# Altium project PowerBoard.PrjPcb
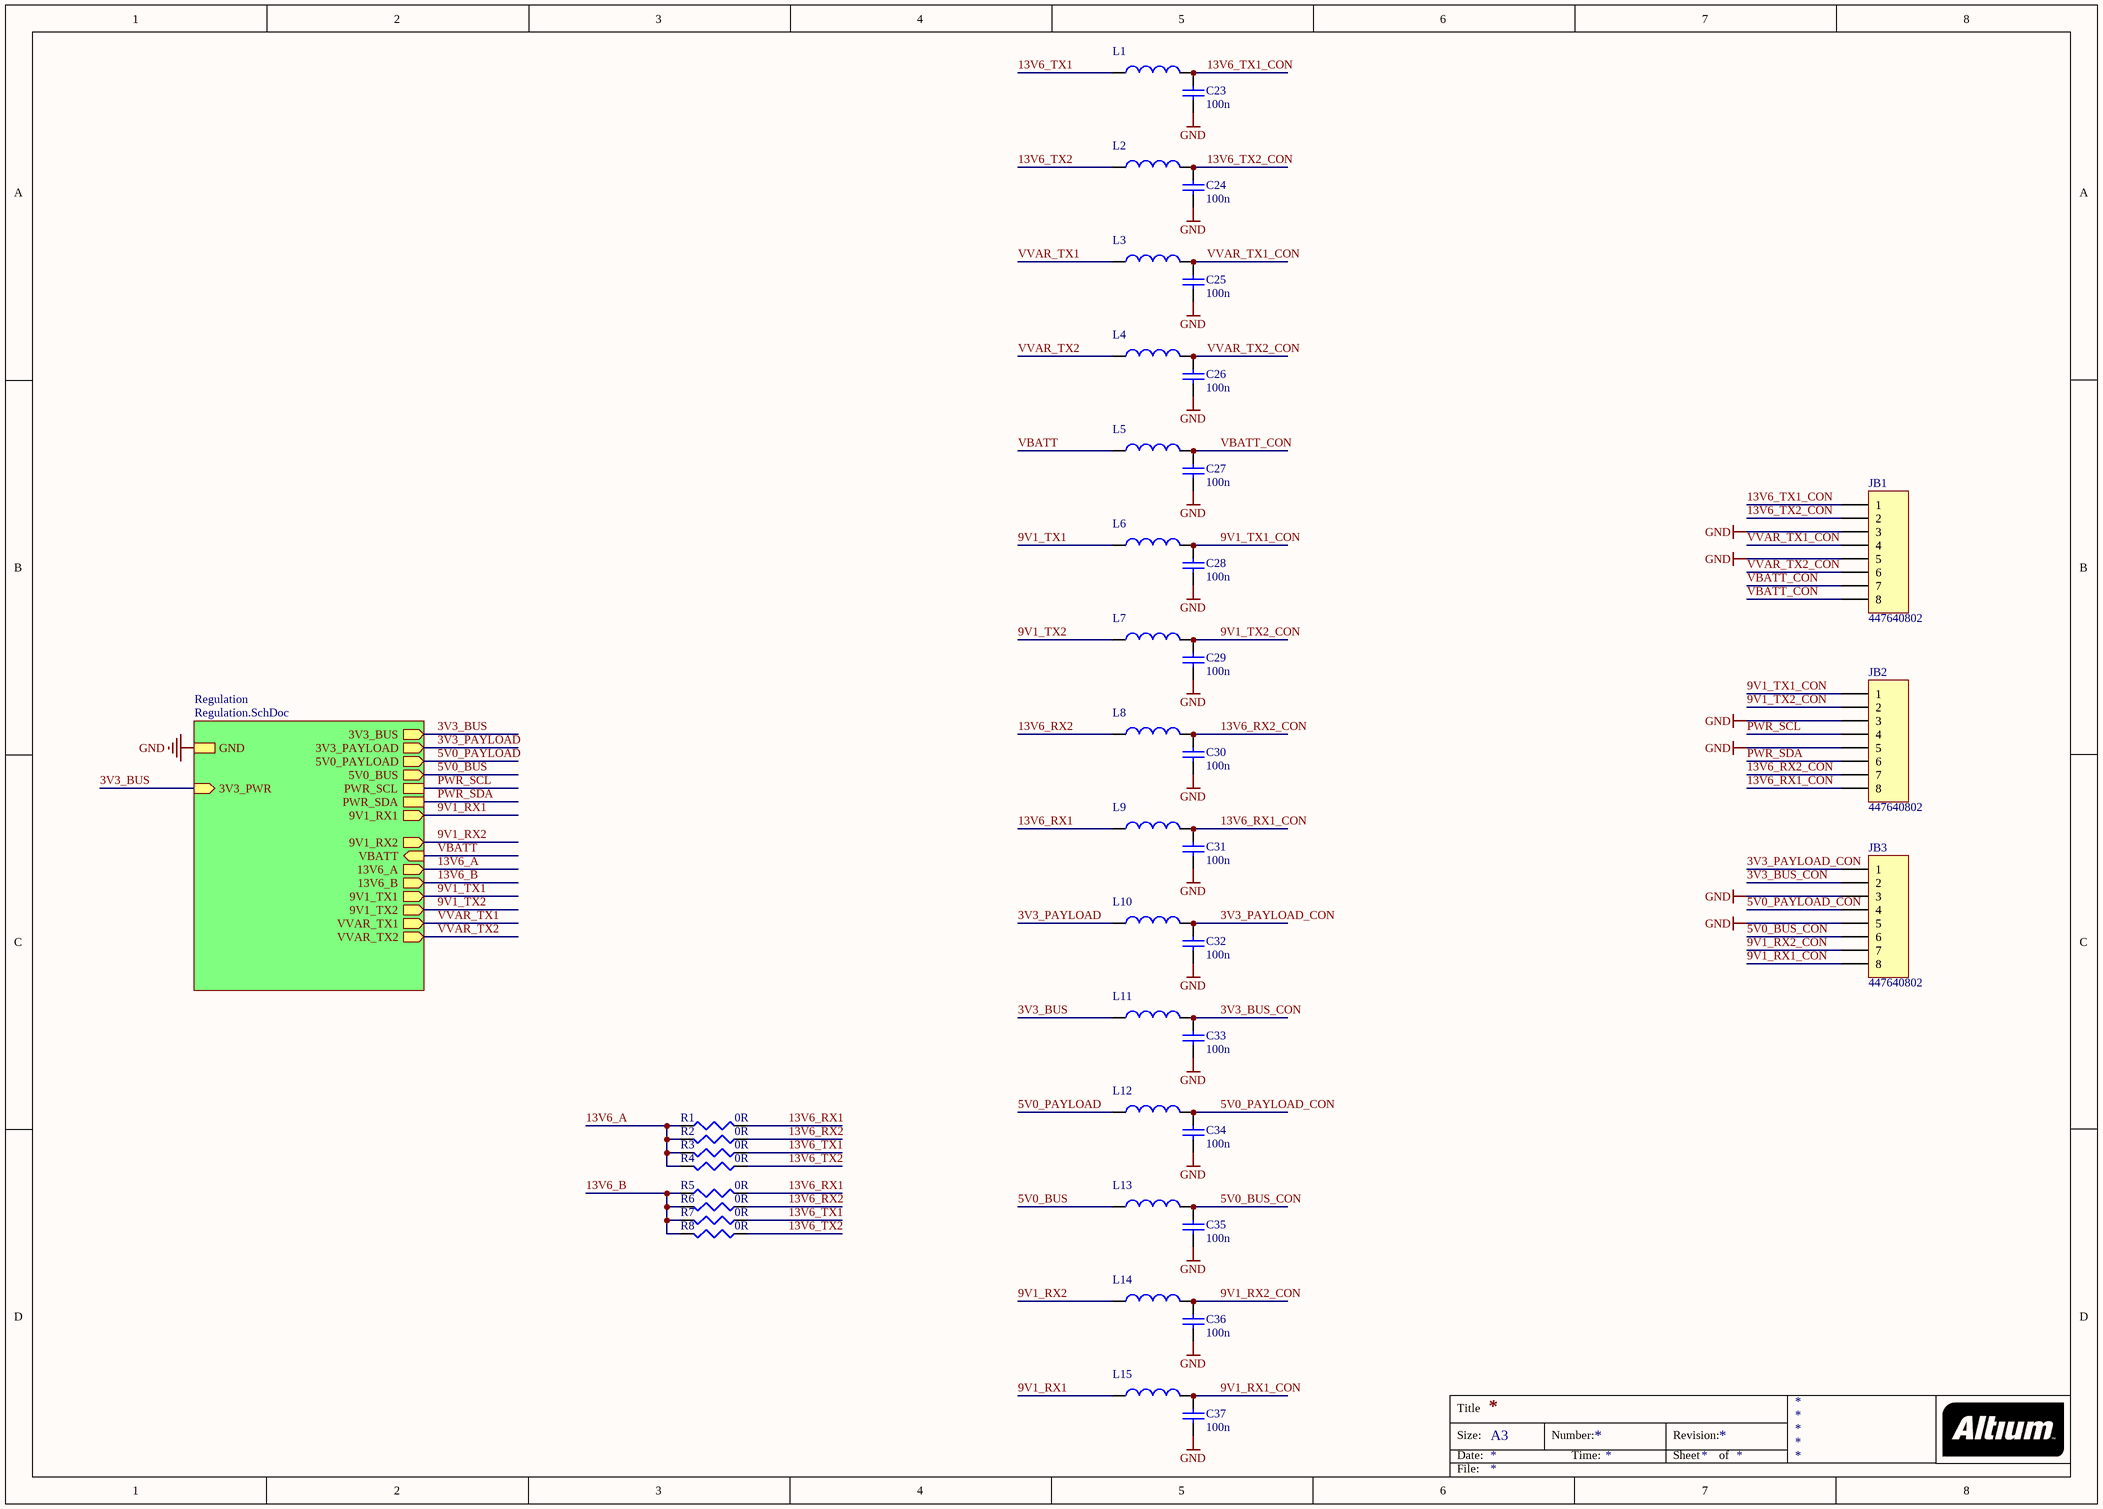
[diagram p0: PowerBoard.SchDoc]
3 sheets, 319 parts. Net scope: strictly hierarchical (ports join the sheet entries above them; power ports are local).
Board files: RedundantReg_Proto.PcbDoc, PowerBoard.PcbDoc
Sheets:
  PowerBoard.SchDoc
    Regulation = Regulation.SchDoc
      13V6 = RedundantReg.SchDoc
      9V1 = RedundantReg.SchDoc
      5V0 = RedundantReg.SchDoc
      3V3 = RedundantReg.SchDoc
      VVAR = RedundantReg.SchDoc

## Sheet PowerBoard.SchDoc
size A3

### Parts
C23  value 100n  [R0805M]
C24  value 100n  [R0805M]
C25  value 100n  [R0805M]
C26  value 100n  [R0805M]
C27  value 100n  [R0805M]
C28  value 100n  [R0805M]
C29  value 100n  [R0805M]
C30  value 100n  [R0805M]
C31  value 100n  [R0805M]
C32  value 100n  [R0805M]
C33  value 100n  [R0805M]
C34  value 100n  [R0805M]
C35  value 100n  [R0805M]
C36  value 100n  [R0805M]
C37  value 100n  [R0805M]
JB1  447640802  [MOLEX 447640802]
JB2  447640802  [MOLEX 447640802]
JB3  447640802  [MOLEX 447640802]
L1  BLM31PG121SN1L  [INDC3216M]  (value not drawn)
L2  BLM31PG121SN1L  [INDC3216M]  (value not drawn)
L3  BLM31PG121SN1L  [INDC3216M]  (value not drawn)
L4  BLM31PG121SN1L  [INDC3216M]  (value not drawn)
L5  BLM31PG121SN1L  [INDC3216M]  (value not drawn)
L6  BLM31PG121SN1L  [INDC3216M]  (value not drawn)
L7  BLM31PG121SN1L  [INDC3216M]  (value not drawn)
L8  BLM31PG121SN1L  [INDC3216M]  (value not drawn)
L9  BLM31PG121SN1L  [INDC3216M]  (value not drawn)
L10  BLM31PG121SN1L  [INDC3216M]  (value not drawn)
L11  BLM31PG121SN1L  [INDC3216M]  (value not drawn)
L12  BLM31PG121SN1L  [INDC3216M]  (value not drawn)
L13  BLM31PG121SN1L  [INDC3216M]  (value not drawn)
L14  BLM31PG121SN1L  [INDC3216M]  (value not drawn)
L15  BLM31PG121SN1L  [INDC3216M]  (value not drawn)
R1  value 0R  [R0402M]
R2  value 0R  [R0402M]
R3  value 0R  [R0402M]
R4  value 0R  [R0402M]
R5  value 0R  [R0402M]
R6  value 0R  [R0402M]
R7  value 0R  [R0402M]
R8  value 0R  [R0402M]

### Sub-sheets
Regulation = Regulation.SchDoc: 5V0_BUS (out), 3V3_BUS (out), 5V0_PAYLOAD (out), 3V3_PAYLOAD (out), 9V1_RX1 (out), 9V1_RX2 (out), VBATT (in), GND, 3V3_PWR (in), VVAR_TX1 (out), 13V6_A (out), 9V1_TX1 (out), VVAR_TX2 (out), 13V6_B (out), 9V1_TX2 (out), PWR_SCL, PWR_SDA

### Nets
3V3_BUS: L11.1 ; sheet Regulation/3V3_BUS, sheet Regulation/3V3_PWR
3V3_PAYLOAD: L10.1 ; sheet Regulation/3V3_PAYLOAD
5V0_BUS: L13.1 ; sheet Regulation/5V0_BUS
5V0_PAYLOAD: L12.1 ; sheet Regulation/5V0_PAYLOAD
9V1_RX1: L15.1 ; sheet Regulation/9V1_RX1
9V1_RX2: L14.1 ; sheet Regulation/9V1_RX2
9V1_TX1: L6.1 ; sheet Regulation/9V1_TX1
9V1_TX2: L7.1 ; sheet Regulation/9V1_TX2
13V6_A: R1.1 R2.2 R3.2 R4.2 ; sheet Regulation/13V6_A
13V6_B: R5.1 R6.2 R7.2 R8.2 ; sheet Regulation/13V6_B
GND: C23.2 C24.2 C25.2 C26.2 C27.2 C28.2 C29.2 C30.2 C31.2 C32.2 C33.2 C34.2 C35.2 C36.2 C37.2 JB1.3 JB1.5 JB2.3 JB2.5 JB3.3 JB3.5 ; sheet Regulation/GND
VBATT: L5.1 ; sheet Regulation/VBATT
VVAR_TX1: L3.1 ; sheet Regulation/VVAR_TX1
VVAR_TX2: L4.1 ; sheet Regulation/VVAR_TX2
3V3_BUS_CON: C33.1 JB3.2 L11.2
3V3_PAYLOAD_CON: C32.1 JB3.1 L10.2
5V0_BUS_CON: C35.1 JB3.6 L13.2
5V0_PAYLOAD_CON: C34.1 JB3.4 L12.2
9V1_RX1_CON: C37.1 JB3.8 L15.2
9V1_RX2_CON: C36.1 JB3.7 L14.2
9V1_TX1_CON: C28.1 JB2.1 L6.2
9V1_TX2_CON: C29.1 JB2.2 L7.2
13V6_RX1: L9.1 R1.2 R5.2
13V6_RX1_CON: C31.1 JB2.8 L9.2
13V6_RX2: L8.1 R2.1 R6.1
13V6_RX2_CON: C30.1 JB2.7 L8.2
13V6_TX1: L1.1 R3.1 R7.1
13V6_TX1_CON: C23.1 JB1.1 L1.2
13V6_TX2: L2.1 R4.1 R8.1
13V6_TX2_CON: C24.1 JB1.2 L2.2
PWR_SCL: JB2.4 ; sheet Regulation/PWR_SCL
PWR_SDA: JB2.6 ; sheet Regulation/PWR_SDA
VBATT_CON: C27.1 JB1.7 JB1.8 L5.2
VVAR_TX1_CON: C25.1 JB1.4 L3.2
VVAR_TX2_CON: C26.1 JB1.6 L4.2

### Notes on the sheet
- Title
- Size:
- Date:
- A3
- Number:
- Time:
- Revision:
- Sheet
- of
- File:

### Library data of the parts
C23-C37 = Cap: Capacitor; Published: 8-Jun-2000; LatestRevisionDate: 17-Jul-2002; LatestRevisionNote: Re-released for DXP Platform.; PackageReference: RAD-0.3; Publisher: Altium Limited; PackageDescription: Radial Cap, Thru-Hole; 2 Leads; 0.3 in Pin Spacing
JB1-JB3 = MOLEX 447640802: B2B RA Receptacle
L1-L15 = Inductor: Ferrite Bead; Code_IEC: 3216M; Value: 120R@100MHz; Published: 8-Jun-2000; LatestRevisionDate: 29-May-2009; LatestRevisionNote: IPC-7351 Footprint Added.; PackageReference: 3216; Publisher: Altium Limited; PackageDescription: Ferrite Bead; Code_JEITA: 1206M
R1-R8 = Res3: Resistor; Published: 8-Jun-2000; LatestRevisionDate: 29-May-2009; LatestRevisionNote: IPC-7351 Footprint Added.; PackageReference: J1-0603; Publisher: Altium Limited; PackageDescription: Chip Resistor

## Sheet Regulation.SchDoc
size A3
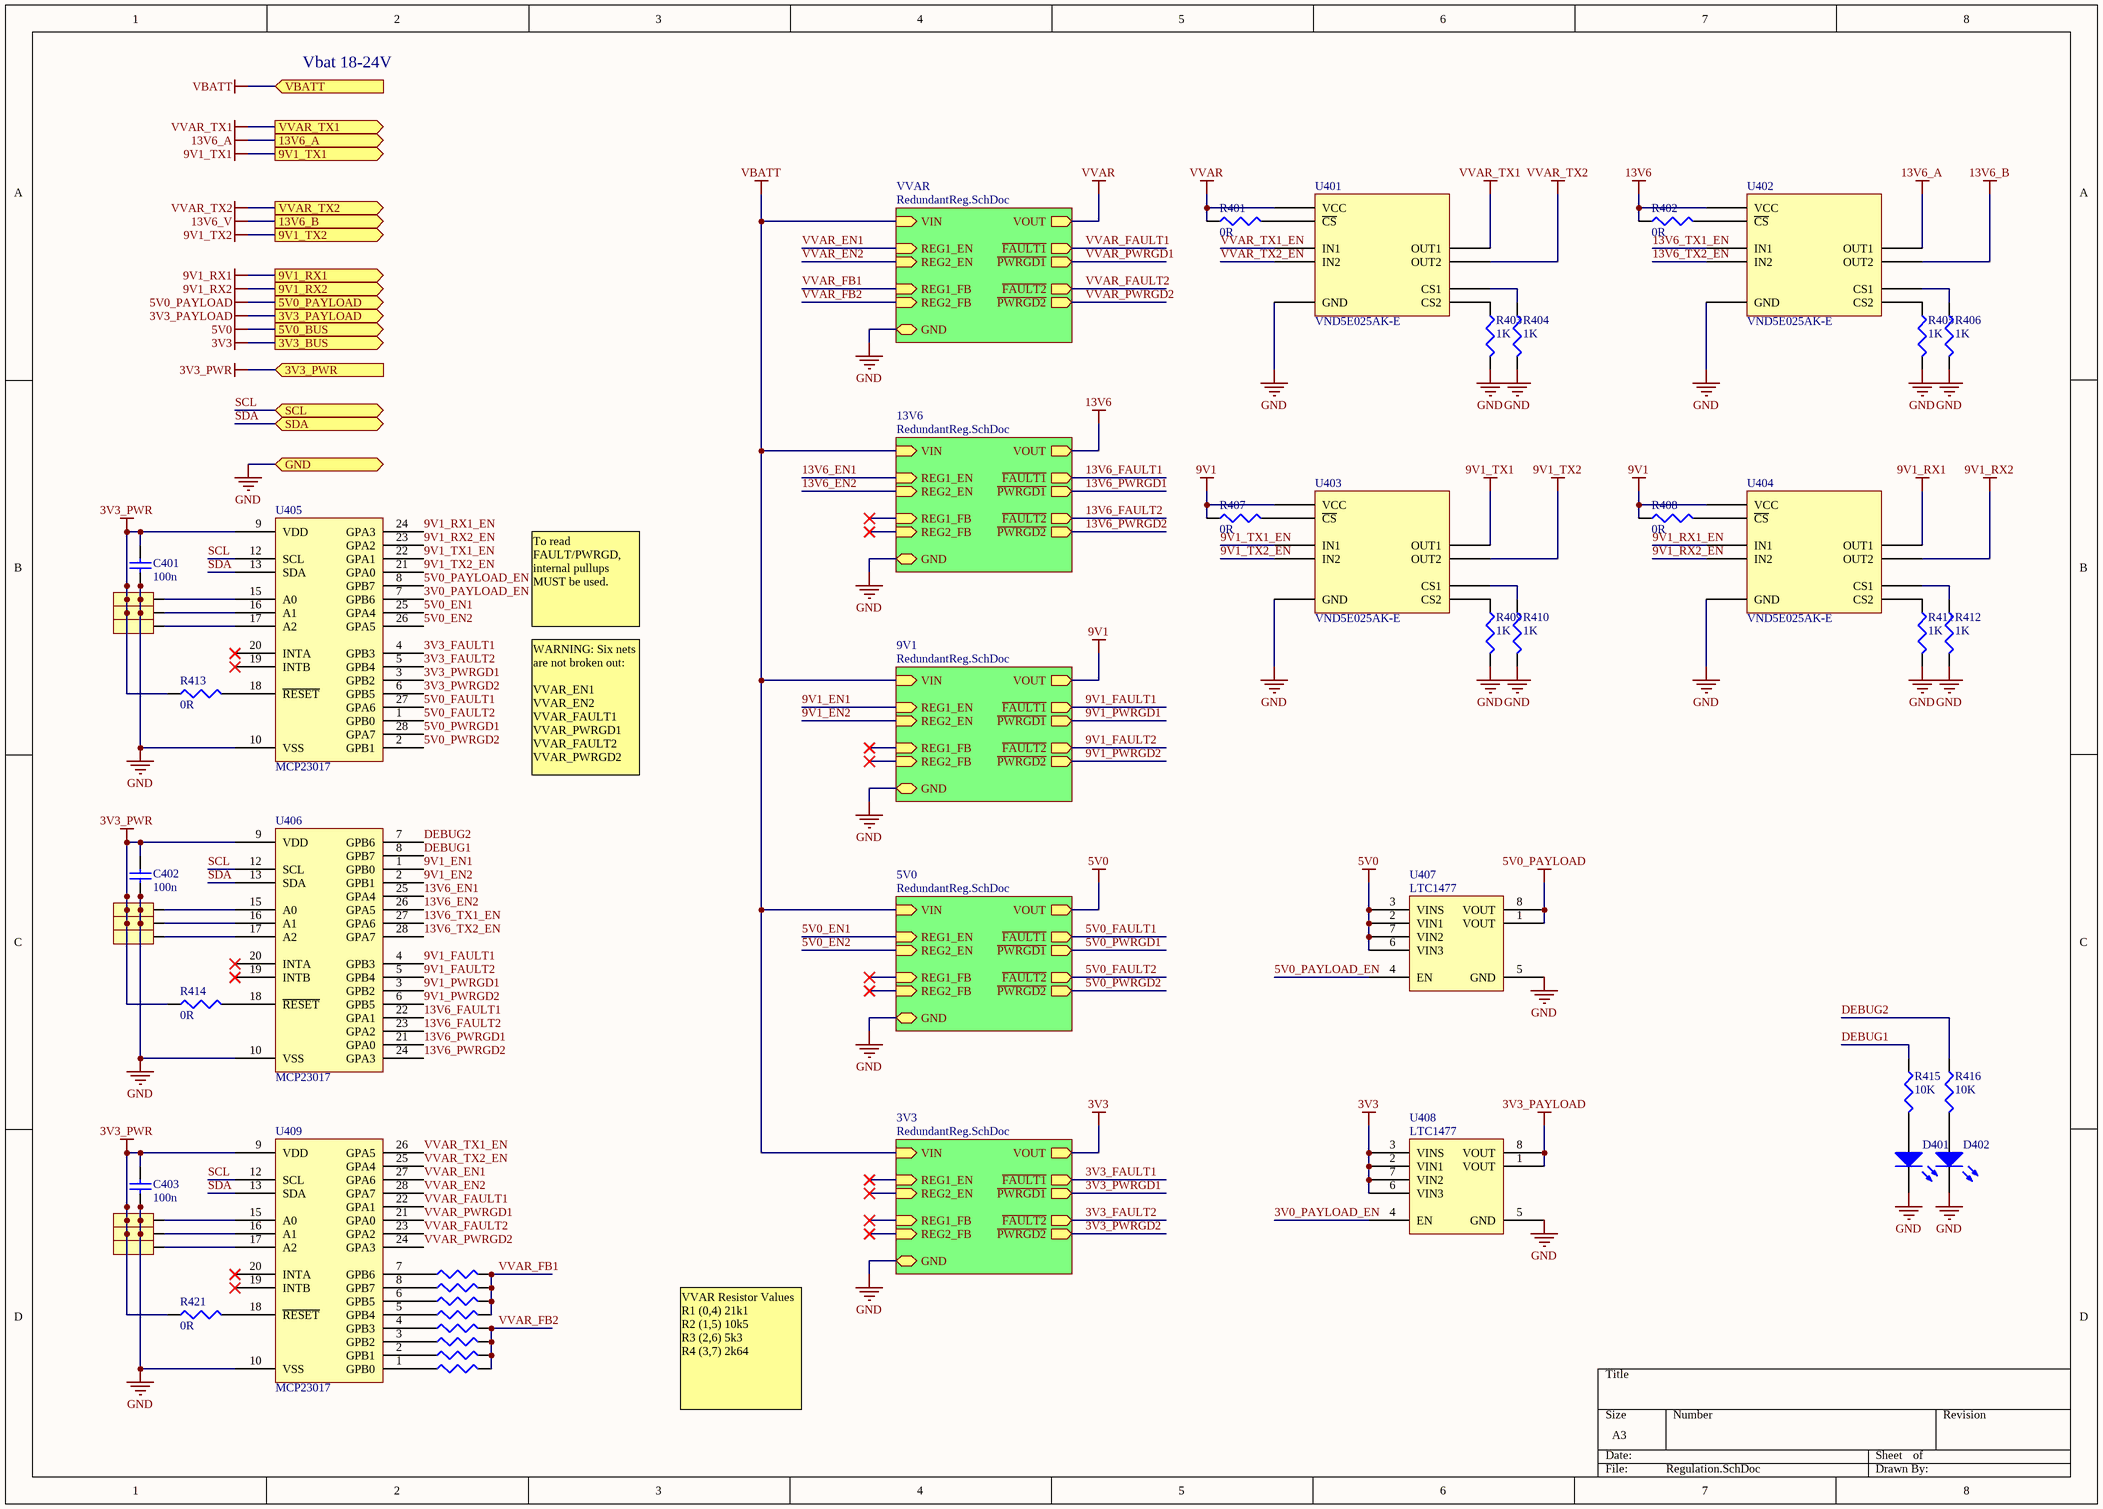
[diagram p1: Regulation.SchDoc]

### Parts
C401  value 100n  [R0805M]
C402  value 100n  [R0805M]
C403  value 100n  [R0805M]
D401  LED0  [R0805M]  (value not drawn)
D402  LED0  [R0805M]  (value not drawn)
J401  3-WAY JUMPER  [J1205M]  (value not drawn)
J402  3-WAY JUMPER  [J1205M]  (value not drawn)
J403  3-WAY JUMPER  [J1205M]  (value not drawn)
J404  3-WAY JUMPER  [J1205M]  (value not drawn)
J405  3-WAY JUMPER  [J1205M]  (value not drawn)
J406  3-WAY JUMPER  [J1205M]  (value not drawn)
J407  3-WAY JUMPER  [J1205M]  (value not drawn)
J408  3-WAY JUMPER  [J1205M]  (value not drawn)
J409  3-WAY JUMPER  [J1205M]  (value not drawn)
R401  value 0R  [R0402M]
R402  value 0R  [R0402M]
R403  value 1K  [R0402M]
R404  value 1K  [R0402M]
R405  value 1K  [R0402M]
R406  value 1K  [R0402M]
R407  value 0R  [R0402M]
R408  value 0R  [R0402M]
R409  value 1K  [R0402M]
R410  value 1K  [R0402M]
R411  value 1K  [R0402M]
R412  value 1K  [R0402M]
R413  value 0R  [R0402M]
R414  value 0R  [R0402M]
R415  value 10K  [R0402M]
R416  value 10K  [R0402M]
R417  VSET_1  [R0805M]  (value not drawn)
R418  VSET_1  [R0805M]  (value not drawn)
R419  VSET_1  [R0805M]  (value not drawn)
R420  VSET_1  [R0805M]  (value not drawn)
R421  value 0R  [R0402M]
R422  VSET_1  [R0805M]  (value not drawn)
R423  VSET_1  [R0805M]  (value not drawn)
R424  VSET_1  [R0805M]  (value not drawn)
R425  VSET_1  [R0805M]  (value not drawn)
U401  VND5E025AK-E  [SSO24]
U402  VND5E025AK-E  [SSO24]
U403  VND5E025AK-E  [SSO24]
U404  VND5E025AK-E  [SSO24]
U405  MCP23017  [SSOP28]
U406  MCP23017  [SSOP28]
U407  LTC1477  [SO8]
U408  LTC1477  [SO8]
U409  MCP23017  [SSOP28]

### Sub-sheets
3V3 = RedundantReg.SchDoc: REG1_EN (in), REG2_EN (in), VIN (in), VOUT (out), REG1_FB (in), REG2_FB (in), GND, ~{FAULT1} (out), ~{FAULT2} (out), ~{PWRGD1} (out), ~{PWRGD2} (out)  | Converter_IC_Variant: LMZ14203EXT; Value_Cout: 22uF; Value_Cout2: 22uF; Value_Isense: 0R10; Value_ON1: 10k13; Value_ON2: 3k13; Value_RFBB: 1k; Value_RFBT: 3k13; Value_RON: 51k1
5V0 = RedundantReg.SchDoc: REG1_EN (in), REG2_EN (in), VIN (in), VOUT (out), REG1_FB (in), REG2_FB (in), GND, ~{FAULT1} (out), ~{FAULT2} (out), ~{PWRGD1} (out), ~{PWRGD2} (out)  | Converter_IC_Varient: LMZ14203H/EXT; Value_Cout: 22uF; Value_Cout2: 22uF; Value_Isense: 0R10; Value_ON1: 10k; Value_ON2: 26k4; Value_RFBB: 1k; Value_RFBT: 5k23; Value_RON: 76k8
9V1 = RedundantReg.SchDoc: REG1_EN (in), REG2_EN (in), VIN (in), VOUT (out), REG1_FB (in), REG2_FB (in), GND, ~{FAULT1} (out), ~{FAULT2} (out), ~{PWRGD1} (out), ~{PWRGD2} (out)  | Convertor_IC_Variant: LMZ14203H; Value_Cout: 22uF; Value_Cout2: 22uF; Value_Isense: 0R10; Value_ON1: 10k; Value_ON2: 59k6; Value_RFBB: 1k; Value_RFBT: 10k38; Value_RON: 164k
13V6 = RedundantReg.SchDoc: REG1_EN (in), REG2_EN (in), VIN (in), VOUT (out), REG1_FB (in), REG2_FB (in), GND, ~{FAULT1} (out), ~{FAULT2} (out), ~{PWRGD1} (out), ~{PWRGD2} (out)  | Convertor_IC_Variant: LMZ14203H; Value_Cout: 22uF; Value_Cout2: 22uF; Value_Isense: 0R10; Value_ON1: 10k; Value_ON2: 95k25; Value_RFBB: 1k; Value_RFBT: 16k; Value_RON: 274k
VVAR = RedundantReg.SchDoc: REG1_EN (in), REG2_EN (in), VIN (in), VOUT (out), REG1_FB (in), REG2_FB (in), GND, ~{FAULT1} (out), ~{FAULT2} (out), ~{PWRGD1} (out), ~{PWRGD2} (out)  | Value_RON: 274k; Value_RFBB: 3k45; Value_RFBT: 16k; Value_Cout: 22uF; Value_ON1: 10k; Value_ON2: 22k4; Value_Isense: 0R10; Value_Cout2: 22uF; Converter_IC_Variant: LMZ14203H

### Ports
3V3_BUS (out), 3V3_PAYLOAD (out), 3V3_PWR (in), 5V0_BUS (out), 5V0_PAYLOAD (out), 9V1_RX1 (out), 9V1_RX2 (out), 9V1_TX1 (out), 9V1_TX2 (out), 13V6_A (out), 13V6_B (out), GND, SCL, SDA, VBATT (in), VVAR_TX1 (out), VVAR_TX2 (out)

### Nets
3V3: C401.1 C402.1 C403.1 J401.1 J402.1 J403.1 J404.1 J405.1 J406.1 J407.1 J408.1 J409.1 R413.1 R414.1 R421.1 U405.9(VDD) U406.9(VDD) U408.2(VIN1) U408.3(VINS) U408.6(VIN3) U408.7(VIN2) U409.9(VDD) ; port 3V3_BUS, port 3V3_PWR, sheet 3V3/VOUT  [also labelled 3V3_PWR]  [project net 3V3_BUS]
3V3_PAYLOAD: U408.1(VOUT) U408.8(VOUT) ; port 3V3_PAYLOAD
5V0: U407.2(VIN1) U407.3(VINS) U407.6(VIN3) U407.7(VIN2) ; port 5V0_BUS, sheet 5V0/VOUT  [project net 5V0_BUS]
5V0_PAYLOAD: U407.1(VOUT) U407.8(VOUT) ; port 5V0_PAYLOAD
9V1: R407.1 R408.1 U403.VCC U404.VCC ; sheet 9V1/VOUT
9V1_RX1: U404.OUT1 ; port 9V1_RX1
9V1_RX2: U404.OUT2 ; port 9V1_RX2
9V1_TX1: U403.OUT1 ; port 9V1_TX1
9V1_TX2: U403.OUT2 ; port 9V1_TX2
13V6: R402.1 U402.VCC ; sheet 13V6/VOUT
13V6_A: U402.OUT1 ; port 13V6_A
13V6_B: U402.OUT2
GND: C401.2 C402.2 C403.2 D401.2(K) D402.2(K) J401.3 J402.3 J403.3 J404.3 J405.3 J406.3 J407.3 J408.3 J409.3 R403.2 R404.2 R405.2 R406.2 R409.2 R410.2 R411.2 R412.2 U401.GND U402.GND U403.GND U404.GND U405.10(VSS) U406.10(VSS) U407.5(GND) U408.5(GND) U409.10(VSS) ; port GND, sheet 13V6/GND, sheet 9V1/GND, sheet 5V0/GND, sheet 3V3/GND, sheet VVAR/GND
VBATT: port VBATT, sheet 13V6/VIN, sheet 9V1/VIN, sheet 5V0/VIN, sheet 3V3/VIN, sheet VVAR/VIN
VVAR: R401.1 U401.VCC ; sheet VVAR/VOUT  [project net VOUT]
VVAR_TX1: U401.OUT1 ; port VVAR_TX1
VVAR_TX2: U401.OUT2 ; port VVAR_TX2
3V0_PAYLOAD_EN: U405.7(GPB6) U408.4(EN)
3V3_FAULT1: U405.4(GPB3) ; sheet 3V3/~{FAULT1}
3V3_FAULT2: U405.5(GPB4) ; sheet 3V3/~{FAULT2}
3V3_PWRGD1: U405.3(GPB2) ; sheet 3V3/~{PWRGD1}
3V3_PWRGD2: U405.6(GPB5) ; sheet 3V3/~{PWRGD2}
5V0_EN1: U405.25(GPA4) ; sheet 5V0/REG1_EN
5V0_EN2: U405.26(GPA5) ; sheet 5V0/REG2_EN
5V0_FAULT1: U405.27(GPA6) ; sheet 5V0/~{FAULT1}
5V0_FAULT2: U405.1(GPB0) ; sheet 5V0/~{FAULT2}
5V0_PAYLOAD_EN: U405.8(GPB7) U407.4(EN)
5V0_PWRGD1: U405.28(GPA7) ; sheet 5V0/~{PWRGD1}
5V0_PWRGD2: U405.2(GPB1) ; sheet 5V0/~{PWRGD2}
9V1_EN1: U406.1(GPB0) ; sheet 9V1/REG1_EN
9V1_EN2: U406.2(GPB1) ; sheet 9V1/REG2_EN
9V1_FAULT1: U406.4(GPB3) ; sheet 9V1/~{FAULT1}
9V1_FAULT2: U406.5(GPB4) ; sheet 9V1/~{FAULT2}
9V1_PWRGD1: U406.3(GPB2) ; sheet 9V1/~{PWRGD1}
9V1_PWRGD2: U406.6(GPB5) ; sheet 9V1/~{PWRGD2}
9V1_RX1_EN: U404.IN1 U405.24(GPA3)
9V1_RX2_EN: U404.IN2 U405.23(GPA2)
9V1_TX1_EN: U403.IN1 U405.22(GPA1)
9V1_TX2_EN: U403.IN2 U405.21(GPA0)
13V6_EN1: U406.25(GPA4) ; sheet 13V6/REG1_EN
13V6_EN2: U406.26(GPA5) ; sheet 13V6/REG2_EN
13V6_FAULT1: U406.22(GPA1) ; sheet 13V6/~{FAULT1}
13V6_FAULT2: U406.23(GPA2) ; sheet 13V6/~{FAULT2}
13V6_PWRGD1: U406.21(GPA0) ; sheet 13V6/~{PWRGD1}
13V6_PWRGD2: U406.24(GPA3) ; sheet 13V6/~{PWRGD2}
13V6_TX1_EN: U402.IN1 U406.27(GPA6)
13V6_TX2_EN: U402.IN2 U406.28(GPA7)
DEBUG1: R415.1 U406.8(GPB7)
DEBUG2: R416.1 U406.7(GPB6)
SCL: U405.12(SCL) U406.12(SCL) U409.12(SCL) ; port SCL
SDA: U405.13(SDA) U406.13(SDA) U409.13(SDA) ; port SDA
VVAR_EN1: U409.27(GPA6) ; sheet VVAR/REG1_EN  [project net REG1_EN]
VVAR_EN2: U409.28(GPA7) ; sheet VVAR/REG2_EN  [project net REG2_EN]
VVAR_FAULT1: U409.22(GPA1) ; sheet VVAR/~{FAULT1}
VVAR_FAULT2: U409.23(GPA2) ; sheet VVAR/~{FAULT2}
VVAR_FB1: R417.2 R418.2 R419.2 R420.2 ; sheet VVAR/REG1_FB  [project net REG1_FB]
VVAR_FB2: R422.2 R423.2 R424.2 R425.2 ; sheet VVAR/REG2_FB  [project net REG2_FB]
VVAR_PWRGD1: U409.21(GPA0) ; sheet VVAR/~{PWRGD1}
VVAR_PWRGD2: U409.24(GPA3) ; sheet VVAR/~{PWRGD2}
VVAR_TX1_EN: U401.IN1 U409.26(GPA5)
VVAR_TX2_EN: U401.IN2 U409.25(GPA4)
NetD401_1: D401.1(A) R415.2
NetD402_1: D402.1(A) R416.2
NetJ401_2: J401.2 U405.15(A0)
NetJ402_2: J402.2 U405.16(A1)
NetJ403_2: J403.2 U405.17(A2)
NetJ404_2: J404.2 U406.15(A0)
NetJ405_2: J405.2 U406.16(A1)
NetJ406_2: J406.2 U406.17(A2)
NetJ407_2: J407.2 U409.15(A0)
NetJ408_2: J408.2 U409.16(A1)
NetJ409_2: J409.2 U409.17(A2)
NetR401_2: R401.2 U401.CS_DIS(~{CS})
NetR402_2: R402.2 U402.CS_DIS(~{CS})
NetR403_1: R403.1 U401.CS2
NetR404_1: R404.1 U401.CS1
NetR405_1: R405.1 U402.CS2
NetR406_1: R406.1 U402.CS1
NetR407_2: R407.2 U403.CS_DIS(~{CS})
NetR408_2: R408.2 U404.CS_DIS(~{CS})
NetR409_1: R409.1 U403.CS2
NetR410_1: R410.1 U403.CS1
NetR411_1: R411.1 U404.CS2
NetR412_1: R412.1 U404.CS1
NetR413_2: R413.2 U405.18(~{RESET})
NetR414_2: R414.2 U406.18(~{RESET})
NetR417_1: R417.1 U409.7(GPB6)
NetR418_1: R418.1 U409.8(GPB7)
NetR419_1: R419.1 U409.6(GPB5)
NetR420_1: R420.1 U409.5(GPB4)
NetR421_2: R421.2 U409.18(~{RESET})
NetR422_1: R422.1 U409.4(GPB3)
NetR423_1: R423.1 U409.3(GPB2)
NetR424_1: R424.1 U409.2(GPB1)
NetR425_1: R425.1 U409.1(GPB0)

Not connected (* = marked no-connect by the designer): U405 19(INTB)* 20(INTA)*; U406 19(INTB)* 20(INTA)*; U409 19(INTB)* 20(INTA)*

### Notes on the sheet
- Vbat 18-24V
- To read FAULT/PWRGD, internal pullups MUST be used.
- WARNING: Six nets are not broken out:
  VVAR_EN1
  VVAR_EN2
  VVAR_FAULT1
  VVAR_PWRGD1
  VVAR_FAULT2
  VVAR_PWRGD2
- VVAR Resistor Values
  R1 (0,4)	21k1
  R2 (1,5)	10k5
  R3 (2,6)	5k3
  R4 (3,7)	2k64

### Library data of the parts
C401-C403 = Cap: Capacitor; Published: 8-Jun-2000; LatestRevisionDate: 17-Jul-2002; LatestRevisionNote: Re-released for DXP Platform.; PackageReference: RAD-0.3; Publisher: Altium Limited; PackageDescription: Radial Cap, Thru-Hole; 2 Leads; 0.3 in Pin Spacing
D401 D402 = LED0: Typical INFRARED GaAs LED; Published: 8-Jun-2000; LatestRevisionDate: 08-Jul-2005; LatestRevisionNote: Mech Layer 1 removed.; PackageReference: LED-0; Publisher: Altium Limited; PackageDescription: LED; 2 Leads
R401-R425 = Res3: Resistor; Published: 8-Jun-2000; LatestRevisionDate: 29-May-2009; LatestRevisionNote: IPC-7351 Footprint Added.; PackageReference: J1-0603; Publisher: Altium Limited; PackageDescription: Chip Resistor
U401-U404 = VND5E025AK-E: Double channel high-side driver with analog current sense
U405 U406 U409 = MCP23017: 16-Bit I/O Expander with Serial Interface
U407 U408 = LTC1477: Single Protected High Side Switches

## Sheet RedundantReg.SchDoc
size A4
Used 5 times, as channels Regulation/13V6, Regulation/9V1, Regulation/5V0, Regulation/3V3, Regulation/VVAR. Parts and nets are listed once, with the designators drawn on the sheet.
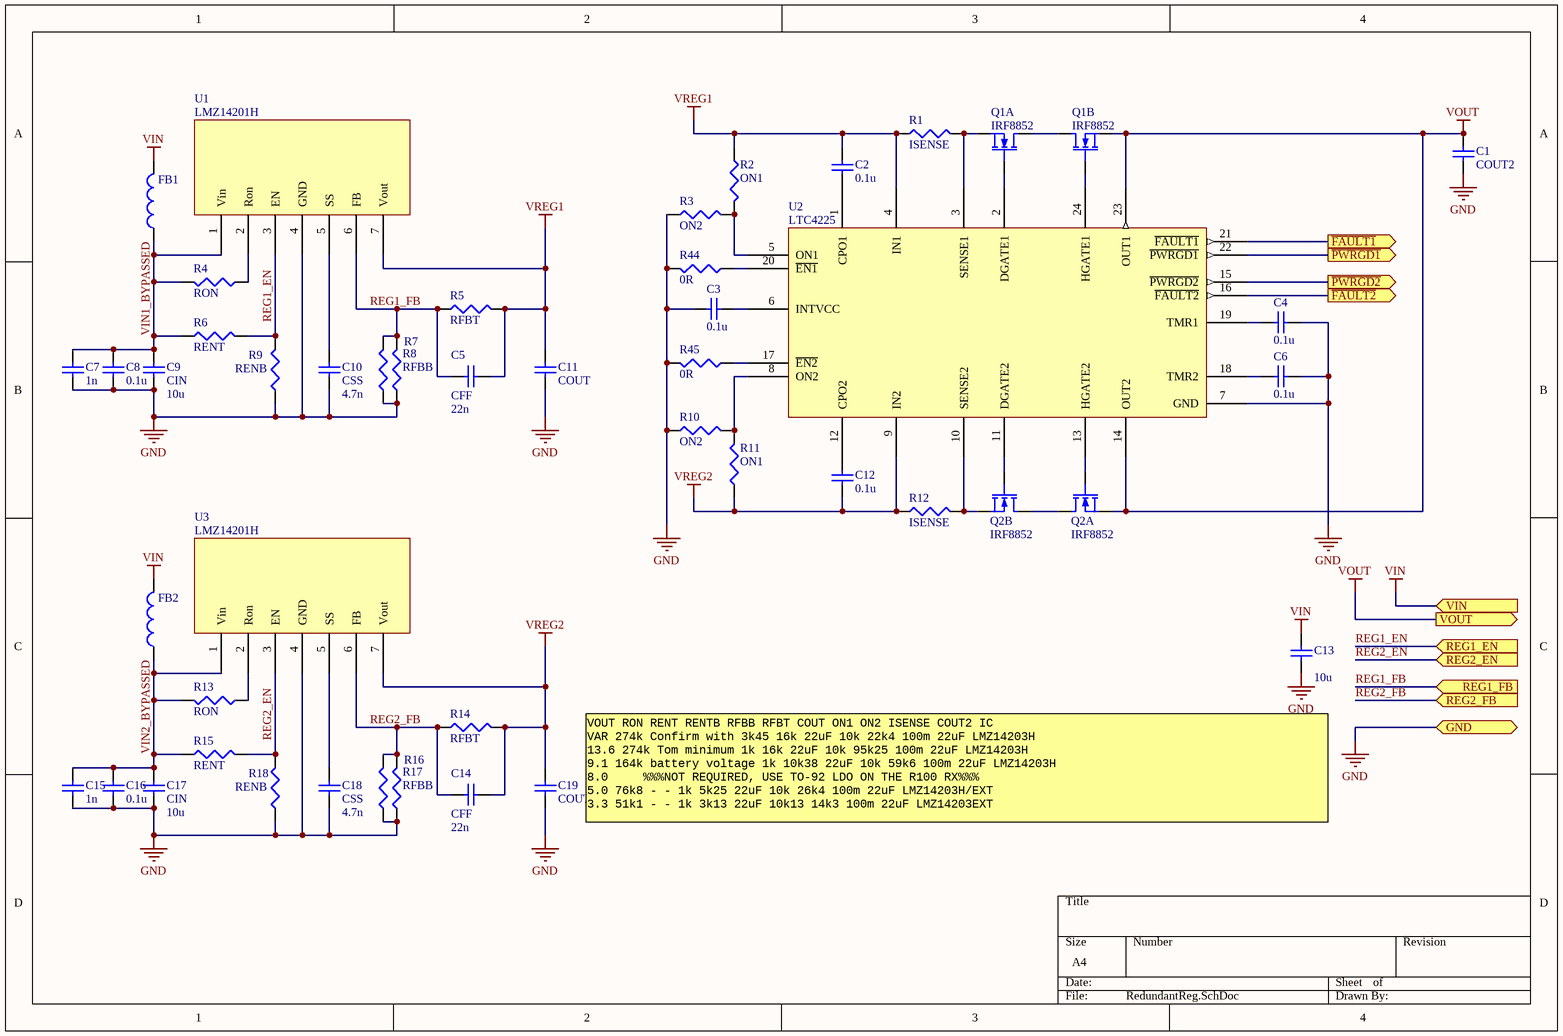
[diagram p2: RedundantReg.SchDoc]

### Parts
C1  COUT2  [R1210M]
C2  value 0.1u  [R0805M]
C3  value 0.1u  [R0805M]
C4  value 0.1u  [R0805M]
C5  CFF  value 22n  [R0805M]
C6  value 0.1u  [R0805M]
C7  value 1n  [R0805M]  (hidden comment: CIN)
C8  value 0.1u  [R0805M]  (hidden comment: CIN)
C9  CIN  value 10u  [R1210M]
C10  CSS  value 4.7n  [R0805M]
C11  COUT  [R1210M]
C12  value 0.1u  [R0805M]
C13  value 10u  [R1210M]
C14  CFF  value 22n  [R0805M]
C15  value 1n  [R0805M]  (hidden comment: CIN)
C16  value 0.1u  [R0805M]  (hidden comment: CIN)
C17  CIN  value 10u  [R1210M]
C18  CSS  value 4.7n  [R0805M]
C19  COUT  [R1210M]
FB1  (no value)  [R0805M]
FB2  (no value)  [R0805M]
Q1  IRF8852  [TSSOP8]  (parts A,B of 2)
Q2  IRF8852  [TSSOP8]  (parts A,B of 2)
R1  ISENSE  [R0805M]
R2  ON1  [R0805M]
R3  ON2  [R0805M]
R4  RON  [R0805M]
R5  RFBT  [R0805M]
R6  RENT  [R0805M]
R7  RFBB  [R0805M]  (value not drawn)
R8  RFBB  [R0805M]
R9  RENB  [R0805M]
R10  ON2  [R0805M]
R11  ON1  [R0805M]
R12  ISENSE  [R0805M]
R13  RON  [R0805M]
R14  RFBT  [R0805M]
R15  RENT  [R0805M]
R16  RFBB  [R0805M]  (value not drawn)
R17  RFBB  [R0805M]
R18  RENB  [R0805M]
R44  value 0R  [R0805M]
R45  value 0R  [R0805M]
U1  LMZ14201H  [TO-PMOD-7]
U2  LTC4225  [SSOP24]
U3  LMZ14201H  [TO-PMOD-7]

### Ports
GND, REG1_EN (in), REG1_FB (in), REG2_EN (in), REG2_FB (in), VIN (in), VOUT (out), ~{FAULT1} (out), ~{FAULT2} (out), ~{PWRGD1} (out), ~{PWRGD2} (out)

### Nets
GND: C1.1 C3.2 C4.1 C6.1 C7.1 C8.1 C9.2 C10.2 C11.1 C13.2 C15.1 C16.1 C17.2 C18.2 C19.1 R3.1 R7.1 R8.1 R9.2 R10.1 R16.1 R17.1 R18.2 R44.2 R45.2 U1.4(GND) U2.7(GND) U3.4(GND) ; port GND
VIN: C13.1 FB1.2 FB2.2 ; port VIN
VOUT: C1.2 Q1.S2(S) Q2.S1(S) U2.14(OUT2) U2.23(OUT1) ; port VOUT
VREG1: C2.1 C5.2 C11.2 R1.1 R2.1 R5.2 U1.7(Vout) U2.4(IN1)
VREG2: C12.2 C14.2 C19.2 R11.1 R12.1 R14.2 U2.9(IN2) U3.7(Vout)
~{FAULT1}: U2.21(~{FAULT1}) ; port ~{FAULT1}
~{FAULT2}: U2.16(~{FAULT2}) ; port ~{FAULT2}
~{PWRGD1}: U2.22(~{PWRGD1}) ; port ~{PWRGD1}
~{PWRGD2}: U2.15(~{PWRGD2}) ; port ~{PWRGD2}
REG1_EN: R6.2 R9.1 U1.3(EN) ; port REG1_EN
REG1_FB: C5.1 R5.1 R7.2 R8.2 U1.6(FB) ; port REG1_FB
REG2_EN: R15.2 R18.1 U3.3(EN) ; port REG2_EN
REG2_FB: C14.1 R14.1 R16.2 R17.2 U3.6(FB) ; port REG2_FB
VIN1_BYPASSED: C7.2 C8.2 C9.1 FB1.1 R4.2 R6.1 U1.1(Vin)
VIN2_BYPASSED: C15.2 C16.2 C17.1 FB2.1 R13.2 R15.1 U3.1(Vin)
NetC2_2: C2.2 U2.1(CPO1)
NetC3_1: C3.1 U2.6(INTVCC)
NetC4_2: C4.2 U2.19(TMR1)
NetC6_2: C6.2 U2.18(TMR2)
NetC10_1: C10.1 U1.5(SS)
NetC12_1: C12.1 U2.12(CPO2)
NetC18_1: C18.1 U3.5(SS)
NetQ1_D1: Q1.D1(D) Q1.D2(D)
NetQ1_G1: Q1.G1(G) U2.2(DGATE1)
NetQ1_G2: Q1.G2(G) U2.24(HGATE1)
NetQ1_S1: Q1.S1(S) R1.2 U2.3(SENSE1)
NetQ2_D1: Q2.D1(D) Q2.D2(D)
NetQ2_G1: Q2.G1(G) U2.13(HGATE2)
NetQ2_G2: Q2.G2(G) U2.11(DGATE2)
NetQ2_S2: Q2.S2(S) R12.2 U2.10(SENSE2)
NetR2_2: R2.2 R3.2 U2.5(ON1)
NetR4_1: R4.1 U1.2(Ron)
NetR10_2: R10.2 R11.2 U2.8(ON2)
NetR13_1: R13.1 U3.2(Ron)
NetR44_1: R44.1 U2.20(~{EN1})
NetR45_1: R45.1 U2.17(~{EN2})

### Channels
Regulation/13V6: designators end in D; ports GND=GND REG1_EN=13V6_EN1 REG1_FB=REG1_FB_13V6 REG2_EN=13V6_EN2 REG2_FB=REG2_FB_13V6 VIN=VBATT VOUT=13V6 ~{FAULT1}=13V6_FAULT1 ~{FAULT2}=13V6_FAULT2 ~{PWRGD1}=13V6_PWRGD1 ~{PWRGD2}=13V6_PWRGD2
Regulation/9V1: designators end in C; ports GND=GND REG1_EN=9V1_EN1 REG1_FB=REG1_FB_9V1 REG2_EN=9V1_EN2 REG2_FB=REG2_FB_9V1 VIN=VBATT VOUT=9V1 ~{FAULT1}=9V1_FAULT1 ~{FAULT2}=9V1_FAULT2 ~{PWRGD1}=9V1_PWRGD1 ~{PWRGD2}=9V1_PWRGD2
Regulation/5V0: designators end in B; ports GND=GND REG1_EN=5V0_EN1 REG1_FB=REG1_FB_5V0 REG2_EN=5V0_EN2 REG2_FB=REG2_FB_5V0 VIN=VBATT VOUT=5V0_BUS ~{FAULT1}=5V0_FAULT1 ~{FAULT2}=5V0_FAULT2 ~{PWRGD1}=5V0_PWRGD1 ~{PWRGD2}=5V0_PWRGD2
Regulation/3V3: designators end in A; ports GND=GND REG1_EN=REG1_EN_3V3 REG1_FB=REG1_FB_3V3 REG2_EN=REG2_EN_3V3 REG2_FB=REG2_FB_3V3 VIN=VBATT VOUT=3V3_BUS ~{FAULT1}=3V3_FAULT1 ~{FAULT2}=3V3_FAULT2 ~{PWRGD1}=3V3_PWRGD1 ~{PWRGD2}=3V3_PWRGD2
Regulation/VVAR: designators end in E; ports GND=GND REG1_EN=REG1_EN REG1_FB=REG1_FB REG2_EN=REG2_EN REG2_FB=REG2_FB VIN=VBATT VOUT=VOUT ~{FAULT1}=VVAR_FAULT1 ~{FAULT2}=VVAR_FAULT2 ~{PWRGD1}=VVAR_PWRGD1 ~{PWRGD2}=VVAR_PWRGD2

### Notes on the sheet
- VOUT	RON	RENT	RENTB	RFBB	RFBT	COUT	ON1	ON2	ISENSE	COUT2	IC
  VAR	274k	Confirm with	3k45	16k	22uF	10k	22k4	100m	22uF	LMZ14203H
  13.6	274k	Tom minimum	1k	16k	22uF	10k	95k25	100m	22uF	LMZ14203H
  9.1	164k	battery voltage	1k	10k38	22uF	10k	59k6	100m	22uF	LMZ14203H
  8.0     %%%NOT REQUIRED, USE TO-92 LDO ON THE R100 RX%%%
  5.0	76k8	-	-	1k	5k25	22uF	10k	26k4	100m	22uF	LMZ14203H/EXT
  3.3	51k1	-	-	1k	3k13	22uF	10k13	14k3	100m	22uF	LMZ14203EXT

### Library data of the parts
C1 C11 C19 = Cap: Capacitor; Value: 100pF; Published: 8-Jun-2000; LatestRevisionDate: 17-Jul-2002; LatestRevisionNote: Re-released for DXP Platform.; PackageReference: RAD-0.3; Publisher: Altium Limited; PackageDescription: Radial Cap, Thru-Hole; 2 Leads; 0.3 in Pin Spacing
C2-C10 C12-C18 = Cap: Capacitor; Published: 8-Jun-2000; LatestRevisionDate: 17-Jul-2002; LatestRevisionNote: Re-released for DXP Platform.; PackageReference: RAD-0.3; Publisher: Altium Limited; PackageDescription: Radial Cap, Thru-Hole; 2 Leads; 0.3 in Pin Spacing
FB1 FB2 = Inductor: Code_IEC: 1005; Value: 10mH; Published: 8-Jun-2000; LatestRevisionDate: 29-May-2009; LatestRevisionNote: IPC-7351 Footprint Added.; PackageReference: 0402-A; Publisher: Altium Limited; PackageDescription: Chip Inductor; Code_JEITA: 0402
Q1 Q2 = IRF8852: N-Channel MOSFET; Published: 8-Jun-2000; LatestRevisionDate: 17-Jul-2002; LatestRevisionNote: Re-released for DXP Platform.; PackageVersion: 1995/1996; PackageReference: E3; Publisher: Altium Limited; PackageDescription: TO, Flat Index; 3 In-Line, Axial Leads; Body Dia. 4.6mm; Lead Dia. 0.5 mm (max)
R1-R18 = Res3: Resistor; Value: 1K; Published: 8-Jun-2000; LatestRevisionDate: 29-May-2009; LatestRevisionNote: IPC-7351 Footprint Added.; PackageReference: J1-0603; Publisher: Altium Limited; PackageDescription: Chip Resistor
R44 R45 = Res3: Resistor; Published: 8-Jun-2000; LatestRevisionDate: 29-May-2009; LatestRevisionNote: IPC-7351 Footprint Added.; PackageReference: J1-0603; Publisher: Altium Limited; PackageDescription: Chip Resistor
U1 U3 = LMZ14201H: 1A SIMPLE SWITCHER® Power Module for High Output  Voltage
U2 = LTC4225: Dual Ideal Diode and  Hot Swap Controller

## Nets that join several sheets
3V3_BUS: PowerBoard (L11.1), Regulation (22 pins), Regulation/3V3 (5 pins)
3V3_PAYLOAD: PowerBoard (L10.1), Regulation (U408.1 U408.8)
5V0_BUS: PowerBoard (L13.1), Regulation (U407.2 U407.3 U407.6 U407.7), Regulation/5V0 (5 pins)
5V0_PAYLOAD: PowerBoard (L12.1), Regulation (U407.1 U407.8)
9V1: Regulation (R407.1 R408.1 U403.VCC U404.VCC), Regulation/9V1 (5 pins)
9V1_RX1: PowerBoard (L15.1), Regulation (U404.OUT1)
9V1_RX2: PowerBoard (L14.1), Regulation (U404.OUT2)
9V1_TX1: PowerBoard (L6.1), Regulation (U403.OUT1)
9V1_TX2: PowerBoard (L7.1), Regulation (U403.OUT2)
13V6: Regulation (R402.1 U402.VCC), Regulation/13V6 (5 pins)
13V6_A: PowerBoard (R1.1 R2.2 R3.2 R4.2), Regulation (U402.OUT1)
GND: PowerBoard (21 pins), Regulation (31 pins), Regulation/13V6 (28 pins), Regulation/9V1 (28 pins), Regulation/5V0 (28 pins), Regulation/3V3 (28 pins), Regulation/VVAR (28 pins)
VBATT: PowerBoard (L5.1), Regulation/13V6 (C13D.1 FB1D.2 FB2D.2), Regulation/9V1 (C13C.1 FB1C.2 FB2C.2), Regulation/5V0 (C13B.1 FB1B.2 FB2B.2), Regulation/3V3 (C13A.1 FB1A.2 FB2A.2), Regulation/VVAR (C13E.1 FB1E.2 FB2E.2)
VOUT: Regulation (R401.1 U401.VCC), Regulation/VVAR (5 pins)
VVAR_TX1: PowerBoard (L3.1), Regulation (U401.OUT1)
VVAR_TX2: PowerBoard (L4.1), Regulation (U401.OUT2)
3V3_FAULT1: Regulation (U405.4), Regulation/3V3 (U2A.21)
3V3_FAULT2: Regulation (U405.5), Regulation/3V3 (U2A.16)
3V3_PWRGD1: Regulation (U405.3), Regulation/3V3 (U2A.22)
3V3_PWRGD2: Regulation (U405.6), Regulation/3V3 (U2A.15)
5V0_EN1: Regulation (U405.25), Regulation/5V0 (R6B.2 R9B.1 U1B.3)
5V0_EN2: Regulation (U405.26), Regulation/5V0 (R15B.2 R18B.1 U3B.3)
5V0_FAULT1: Regulation (U405.27), Regulation/5V0 (U2B.21)
5V0_FAULT2: Regulation (U405.1), Regulation/5V0 (U2B.16)
5V0_PWRGD1: Regulation (U405.28), Regulation/5V0 (U2B.22)
5V0_PWRGD2: Regulation (U405.2), Regulation/5V0 (U2B.15)
9V1_EN1: Regulation (U406.1), Regulation/9V1 (R6C.2 R9C.1 U1C.3)
9V1_EN2: Regulation (U406.2), Regulation/9V1 (R15C.2 R18C.1 U3C.3)
9V1_FAULT1: Regulation (U406.4), Regulation/9V1 (U2C.21)
9V1_FAULT2: Regulation (U406.5), Regulation/9V1 (U2C.16)
9V1_PWRGD1: Regulation (U406.3), Regulation/9V1 (U2C.22)
9V1_PWRGD2: Regulation (U406.6), Regulation/9V1 (U2C.15)
13V6_EN1: Regulation (U406.25), Regulation/13V6 (R6D.2 R9D.1 U1D.3)
13V6_EN2: Regulation (U406.26), Regulation/13V6 (R15D.2 R18D.1 U3D.3)
13V6_FAULT1: Regulation (U406.22), Regulation/13V6 (U2D.21)
13V6_FAULT2: Regulation (U406.23), Regulation/13V6 (U2D.16)
13V6_PWRGD1: Regulation (U406.21), Regulation/13V6 (U2D.22)
13V6_PWRGD2: Regulation (U406.24), Regulation/13V6 (U2D.15)
REG1_EN: Regulation (U409.27), Regulation/VVAR (R6E.2 R9E.1 U1E.3)
REG1_FB: Regulation (R417.2 R418.2 R419.2 R420.2), Regulation/VVAR (5 pins)
REG2_EN: Regulation (U409.28), Regulation/VVAR (R15E.2 R18E.1 U3E.3)
REG2_FB: Regulation (R422.2 R423.2 R424.2 R425.2), Regulation/VVAR (5 pins)
VVAR_FAULT1: Regulation (U409.22), Regulation/VVAR (U2E.21)
VVAR_FAULT2: Regulation (U409.23), Regulation/VVAR (U2E.16)
VVAR_PWRGD1: Regulation (U409.21), Regulation/VVAR (U2E.22)
VVAR_PWRGD2: Regulation (U409.24), Regulation/VVAR (U2E.15)